# Altium schematic sheet FPGA_connector.SchDoc
size A3; SheetNumber: 13; SheetTotal: 15
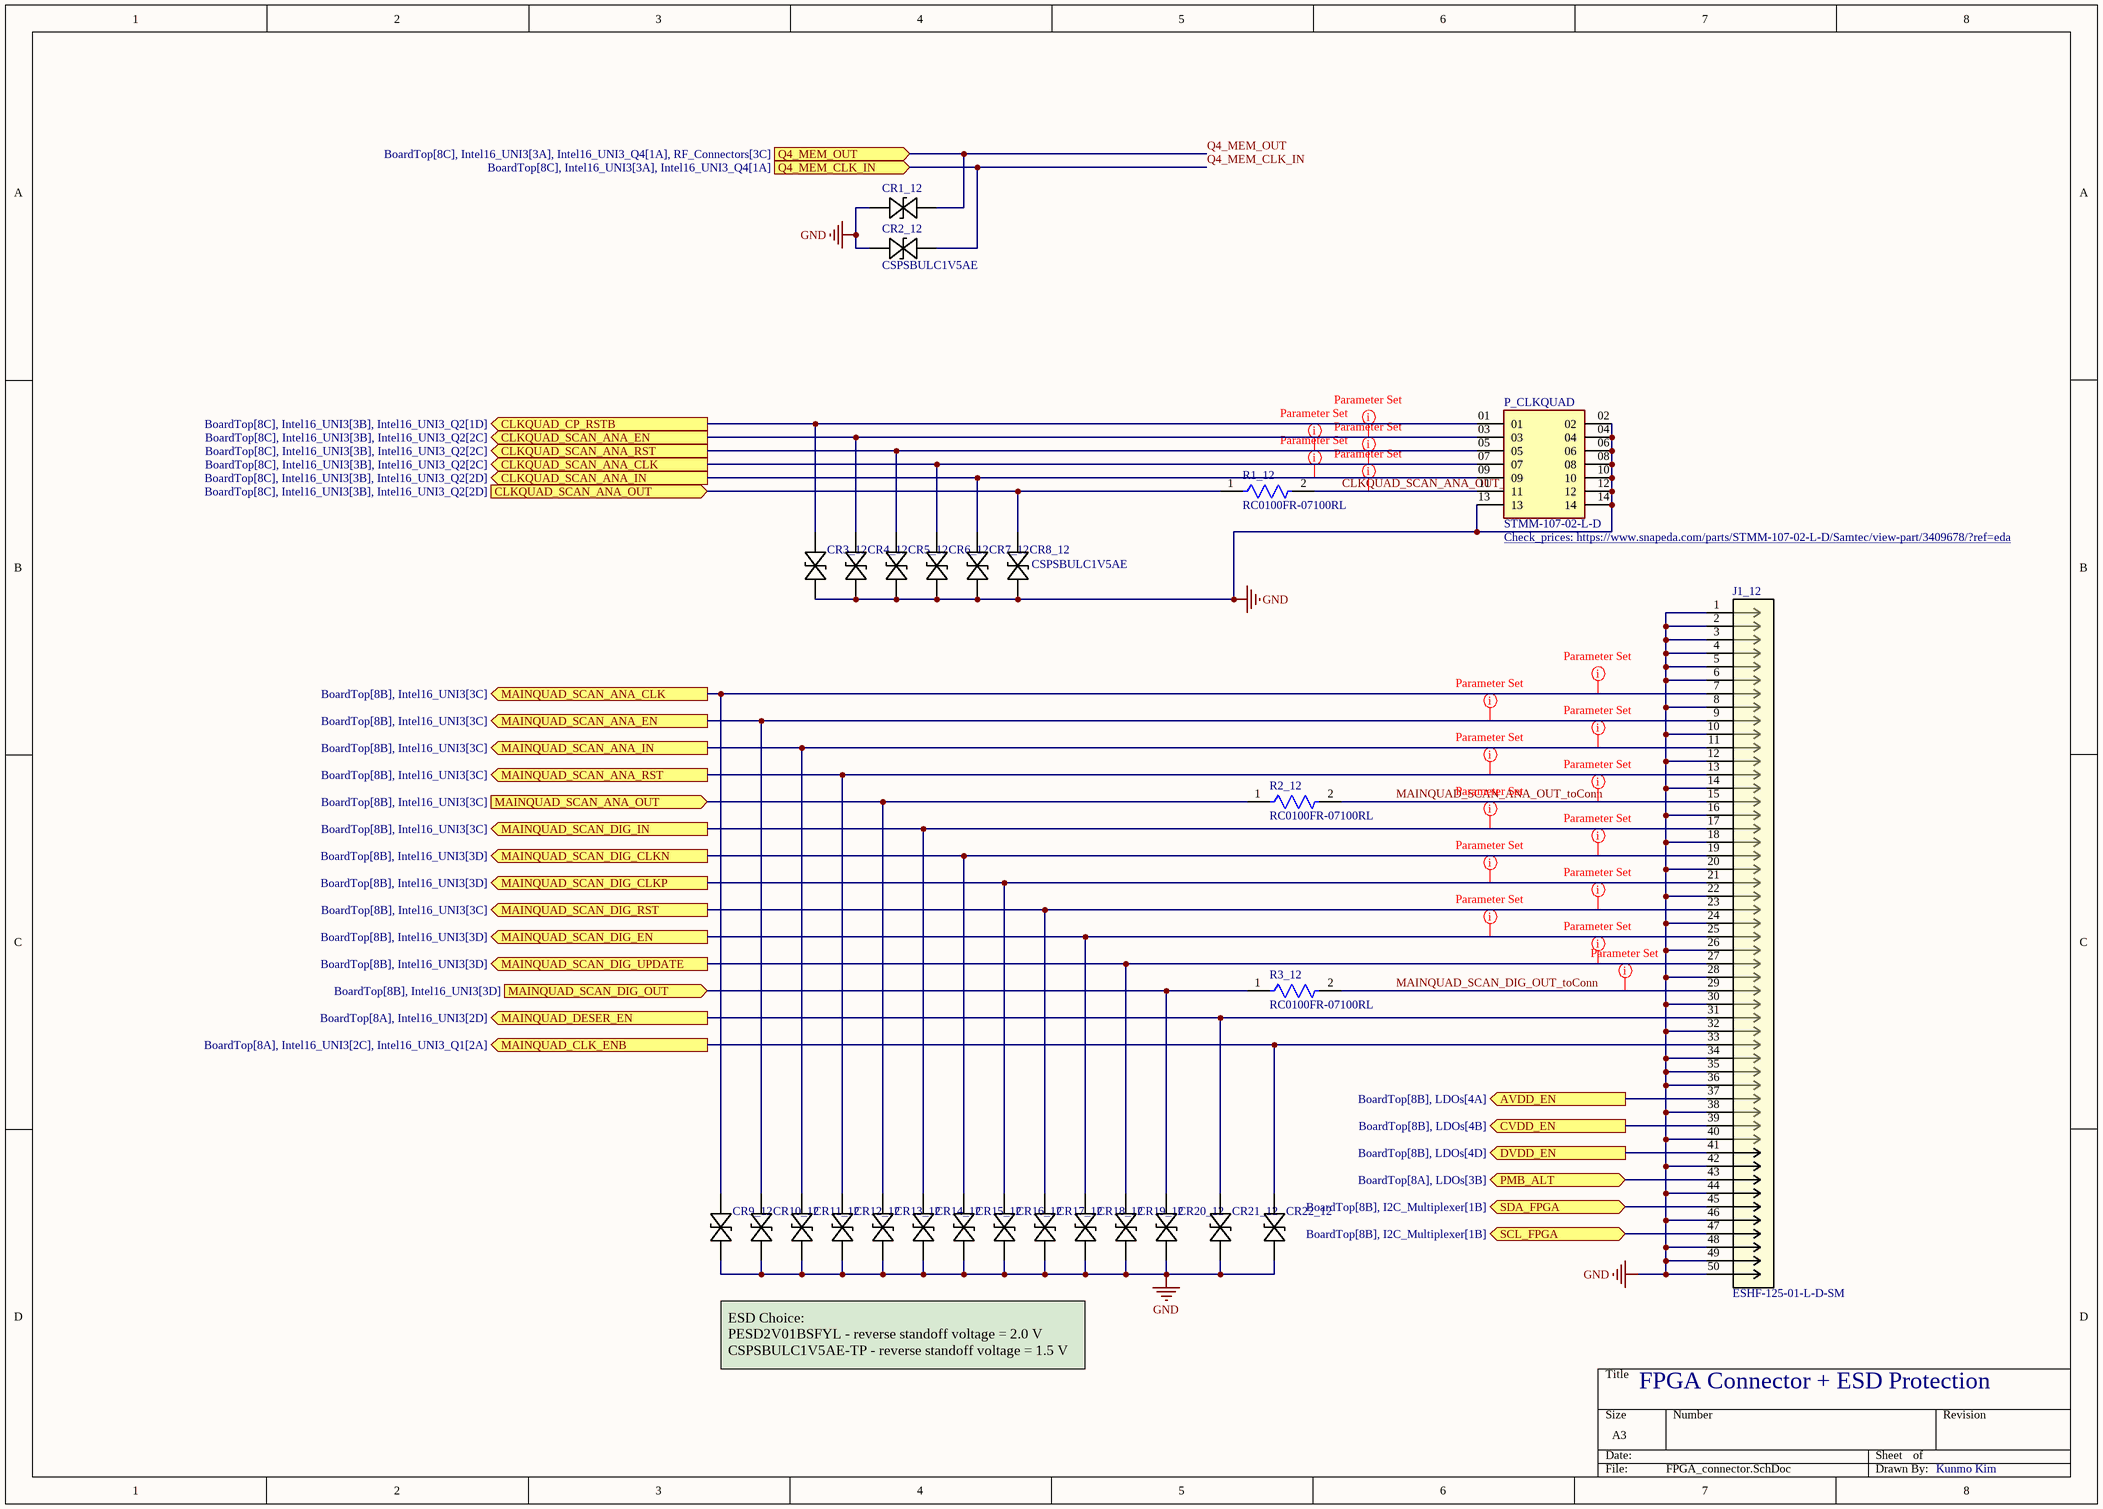
[diagram p0: FPGA_connector.SchDoc]

## Parts
CR1_12  CSPSBULC1V5AE  [WLL-2-1_INF]  (value not drawn)
CR2_12  CSPSBULC1V5AE  [WLL-2-1_INF]
CR3_12  CSPSBULC1V5AE  [WLL-2-1_INF]  (value not drawn)
CR4_12  CSPSBULC1V5AE  [WLL-2-1_INF]  (value not drawn)
CR5_12  CSPSBULC1V5AE  [WLL-2-1_INF]  (value not drawn)
CR6_12  CSPSBULC1V5AE  [WLL-2-1_INF]  (value not drawn)
CR7_12  CSPSBULC1V5AE  [WLL-2-1_INF]  (value not drawn)
CR8_12  CSPSBULC1V5AE  [WLL-2-1_INF]
CR9_12  CSPSBULC1V5AE  [WLL-2-1_INF]  (value not drawn)
CR10_12  CSPSBULC1V5AE  [WLL-2-1_INF]  (value not drawn)
CR11_12  CSPSBULC1V5AE  [WLL-2-1_INF]  (value not drawn)
CR12_12  CSPSBULC1V5AE  [WLL-2-1_INF]  (value not drawn)
CR13_12  CSPSBULC1V5AE  [WLL-2-1_INF]  (value not drawn)
CR14_12  CSPSBULC1V5AE  [WLL-2-1_INF]  (value not drawn)
CR15_12  CSPSBULC1V5AE  [WLL-2-1_INF]  (value not drawn)
CR16_12  CSPSBULC1V5AE  [WLL-2-1_INF]  (value not drawn)
CR17_12  CSPSBULC1V5AE  [WLL-2-1_INF]  (value not drawn)
CR18_12  CSPSBULC1V5AE  [WLL-2-1_INF]  (value not drawn)
CR19_12  CSPSBULC1V5AE  [WLL-2-1_INF]  (value not drawn)
CR20_12  CSPSBULC1V5AE  [WLL-2-1_INF]  (value not drawn)
CR21_12  CSPSBULC1V5AE  [WLL-2-1_INF]  (value not drawn)
CR22_12  CSPSBULC1V5AE  [WLL-2-1_INF]  (value not drawn)
J1_12  ESHF-125-01-L-D-SM  [CONN_ESHF-125-01-x-D-SM_SAI]
P_CLKQUAD  STMM-107-02-L-D  [SAMTEC_STMM-107-02-L-D]
R1_12  RC0100FR-07100RL  [FP-RC0100-0_15-MFG]
R2_12  RC0100FR-07100RL  [FP-RC0100-0_15-MFG]
R3_12  RC0100FR-07100RL  [FP-RC0100-0_15-MFG]

## Ports
AVDD_EN (out, see BoardTop[8B], LDOs[4A]), CLKQUAD_CP_RSTB (out, see BoardTop[8C], Intel16_UNI3[3B], Intel16_UNI3_Q2[1D]), CLKQUAD_SCAN_ANA_CLK (out, see BoardTop[8C], Intel16_UNI3[3B], Intel16_UNI3_Q2[2C]), CLKQUAD_SCAN_ANA_EN (out, see BoardTop[8C], Intel16_UNI3[3B], Intel16_UNI3_Q2[2C]), CLKQUAD_SCAN_ANA_IN (out, see BoardTop[8C], Intel16_UNI3[3B], Intel16_UNI3_Q2[2D]), CLKQUAD_SCAN_ANA_OUT (in, see BoardTop[8C], Intel16_UNI3[3B], Intel16_UNI3_Q2[2D]), CLKQUAD_SCAN_ANA_RST (out, see BoardTop[8C], Intel16_UNI3[3B], Intel16_UNI3_Q2[2C]), CVDD_EN (out, see BoardTop[8B], LDOs[4B]), DVDD_EN (out, see BoardTop[8B], LDOs[4D]), MAINQUAD_CLK_ENB (out, see BoardTop[8A], Intel16_UNI3[2C], Intel16_UNI3_Q1[2A]), MAINQUAD_DESER_EN (out, see BoardTop[8A], Intel16_UNI3[2D]), MAINQUAD_SCAN_ANA_CLK (out, see BoardTop[8B], Intel16_UNI3[3C]), MAINQUAD_SCAN_ANA_EN (out, see BoardTop[8B], Intel16_UNI3[3C]), MAINQUAD_SCAN_ANA_IN (out, see BoardTop[8B], Intel16_UNI3[3C]), MAINQUAD_SCAN_ANA_OUT (in, see BoardTop[8B], Intel16_UNI3[3C]), MAINQUAD_SCAN_ANA_RST (out, see BoardTop[8B], Intel16_UNI3[3C]), MAINQUAD_SCAN_DIG_CLKN (out, see BoardTop[8B], Intel16_UNI3[3D]), MAINQUAD_SCAN_DIG_CLKP (out, see BoardTop[8B], Intel16_UNI3[3D]), MAINQUAD_SCAN_DIG_EN (out, see BoardTop[8B], Intel16_UNI3[3D]), MAINQUAD_SCAN_DIG_IN (out, see BoardTop[8B], Intel16_UNI3[3C]), MAINQUAD_SCAN_DIG_OUT (in, see BoardTop[8B], Intel16_UNI3[3D]), MAINQUAD_SCAN_DIG_RST (out, see BoardTop[8B], Intel16_UNI3[3C]), MAINQUAD_SCAN_DIG_UPDATE (out, see BoardTop[8B], Intel16_UNI3[3D]), PMB_ALT (bidir, see BoardTop[8A], LDOs[3B]), Q4_MEM_CLK_IN (in, see BoardTop[8C], Intel16_UNI3[3A], Intel16_UNI3_Q4[1A]), Q4_MEM_OUT (in, see BoardTop[8C], Intel16_UNI3[3A], Intel16_UNI3_Q4[1A], RF_Connectors[3C]), SCL_FPGA (bidir, see BoardTop[8B], I2C_Multiplexer[1B]), SDA_FPGA (bidir, see BoardTop[8B], I2C_Multiplexer[1B])

## Nets
GND: CR1_12.1 CR2_12.1 CR3_12.2 CR4_12.2 CR5_12.2 CR6_12.2 CR7_12.2 CR8_12.2 CR9_12.2 CR10_12.2 CR11_12.2 CR12_12.2 CR13_12.2 CR14_12.2 CR15_12.2 CR16_12.2 CR17_12.2 CR18_12.2 CR19_12.2 CR20_12.2 CR21_12.2 CR22_12.2 J1_12.1 J1_12.2 J1_12.3 J1_12.4 J1_12.5 J1_12.6 J1_12.8 J1_12.10 J1_12.12 J1_12.14 J1_12.16 J1_12.18 J1_12.20 J1_12.22 J1_12.24 J1_12.26 J1_12.28 J1_12.30 J1_12.32 J1_12.34 J1_12.35 J1_12.36 J1_12.38 J1_12.40 J1_12.42 J1_12.44 J1_12.46 J1_12.48 J1_12.49 J1_12.50 P_CLKQUAD.02 P_CLKQUAD.04 P_CLKQUAD.06 P_CLKQUAD.08 P_CLKQUAD.10 P_CLKQUAD.12 P_CLKQUAD.13 P_CLKQUAD.14
AVDD_EN: J1_12.37 ; port AVDD_EN
CLKQUAD_CP_RSTB: CR3_12.1 P_CLKQUAD.01 ; port CLKQUAD_CP_RSTB
CLKQUAD_SCAN_ANA_CLK: CR6_12.1 P_CLKQUAD.07 ; port CLKQUAD_SCAN_ANA_CLK
CLKQUAD_SCAN_ANA_EN: CR4_12.1 P_CLKQUAD.03 ; port CLKQUAD_SCAN_ANA_EN
CLKQUAD_SCAN_ANA_IN: CR7_12.1 P_CLKQUAD.09 ; port CLKQUAD_SCAN_ANA_IN
CLKQUAD_SCAN_ANA_OUT: CR8_12.1 R1_12.1 ; port CLKQUAD_SCAN_ANA_OUT
CLKQUAD_SCAN_ANA_OUT_toConn: P_CLKQUAD.11 R1_12.2
CLKQUAD_SCAN_ANA_RST: CR5_12.1 P_CLKQUAD.05 ; port CLKQUAD_SCAN_ANA_RST
CVDD_EN: J1_12.39 ; port CVDD_EN
DVDD_EN: J1_12.41 ; port DVDD_EN
MAINQUAD_CLK_ENB: CR22_12.1 J1_12.33 ; port MAINQUAD_CLK_ENB
MAINQUAD_DESER_EN: CR21_12.1 J1_12.31 ; port MAINQUAD_DESER_EN
MAINQUAD_SCAN_ANA_CLK: CR9_12.1 J1_12.7 ; port MAINQUAD_SCAN_ANA_CLK
MAINQUAD_SCAN_ANA_EN: CR10_12.1 J1_12.9 ; port MAINQUAD_SCAN_ANA_EN
MAINQUAD_SCAN_ANA_IN: CR11_12.1 J1_12.11 ; port MAINQUAD_SCAN_ANA_IN
MAINQUAD_SCAN_ANA_OUT: CR13_12.1 R2_12.1 ; port MAINQUAD_SCAN_ANA_OUT
MAINQUAD_SCAN_ANA_OUT_toConn: J1_12.15 R2_12.2
MAINQUAD_SCAN_ANA_RST: CR12_12.1 J1_12.13 ; port MAINQUAD_SCAN_ANA_RST
MAINQUAD_SCAN_DIG_CLKN: CR15_12.1 J1_12.19 ; port MAINQUAD_SCAN_DIG_CLKN
MAINQUAD_SCAN_DIG_CLKP: CR16_12.1 J1_12.21 ; port MAINQUAD_SCAN_DIG_CLKP
MAINQUAD_SCAN_DIG_EN: CR18_12.1 J1_12.25 ; port MAINQUAD_SCAN_DIG_EN
MAINQUAD_SCAN_DIG_IN: CR14_12.1 J1_12.17 ; port MAINQUAD_SCAN_DIG_IN
MAINQUAD_SCAN_DIG_OUT: CR20_12.1 R3_12.1 ; port MAINQUAD_SCAN_DIG_OUT
MAINQUAD_SCAN_DIG_OUT_toConn: J1_12.29 R3_12.2
MAINQUAD_SCAN_DIG_RST: CR17_12.1 J1_12.23 ; port MAINQUAD_SCAN_DIG_RST
MAINQUAD_SCAN_DIG_UPDATE: CR19_12.1 J1_12.27 ; port MAINQUAD_SCAN_DIG_UPDATE
PMB_ALT: J1_12.43 ; port PMB_ALT
Q4_MEM_CLK_IN: CR2_12.2 ; port Q4_MEM_CLK_IN
Q4_MEM_OUT: CR1_12.2 ; port Q4_MEM_OUT
SCL_FPGA: J1_12.47 ; port SCL_FPGA
SDA_FPGA: J1_12.45 ; port SDA_FPGA

## Layout directives
net class CLKQUAD_SCAN_ANA: CLKQUAD_SCAN_ANA_CLK, CLKQUAD_SCAN_ANA_EN, CLKQUAD_SCAN_ANA_IN, CLKQUAD_SCAN_ANA_OUT_toConn, CLKQUAD_SCAN_ANA_RST
net class MAINQUAD_SCAN_ANA: MAINQUAD_SCAN_ANA_CLK, MAINQUAD_SCAN_ANA_EN, MAINQUAD_SCAN_ANA_IN, MAINQUAD_SCAN_ANA_OUT_toConn, MAINQUAD_SCAN_ANA_RST
net class MAINQUAD_SCAN_DIG: MAINQUAD_SCAN_DIG_CLKN, MAINQUAD_SCAN_DIG_CLKP, MAINQUAD_SCAN_DIG_EN, MAINQUAD_SCAN_DIG_IN, MAINQUAD_SCAN_DIG_OUT_toConn, MAINQUAD_SCAN_DIG_RST, MAINQUAD_SCAN_DIG_UPDATE

## Notes on the sheet
- ESD Choice:
  PESD2V01BSFYL - reverse standoff voltage = 2.0 V
  CSPSBULC1V5AE-TP - reverse standoff voltage = 1.5 V
- FPGA Connector + ESD Protection
- Kunmo Kim

## Library data of the parts
CR1_12 CR2_12 CR3_12 CR4_12 CR5_12 CR6_12 CR7_12 CR8_12 CR9_12 CR10_12 CR11_12 CR12_12 CR13_12 CR14_12 CR15_12 CR16_12 CR17_12 CR18_12 CR19_12 CR20_12 CR21_12 CR22_12 = ESD108B1CSP0201XTSA1: No Description Available; Mfr_Name: Infineon
J1_12 = ESHF-125-01-L-D-SM: No Description Available; Mfr_Name: Samtec Inc; Type: Headers, Male Pins; RefDes: RefDes; Supplier 1: Digikey; Supplier Part Number 1: SAM15560-ND; ClassName: InputPowerComponent
P_CLKQUAD = STMM-107-02-L-D: Connector Header Surface Mount 14 position 0.079 (2.00mm); MF: Samtec; MP: STMM-107-02-L-D; SnapEDA_Link: https://www.snapeda.com/parts/STMM-107-02-L-D/Samtec/view-part/3409678/?ref=snap; Package: None; Value: *; Digi-Key_Part_Number: STMM-107-02-L-D-SM-TR-ND; Supplier 1: Mouser; Supplier Part Number 1: 200-STMM10702LD; Check_prices: https://www.snapeda.com/parts/STMM-107-02-L-D/Samtec/view-part/3409678/?ref=eda
R1_12 R2_12 R3_12 = yageo_100ohm: RES SMD 100 OHM 1% 1/32W 01005; Resistance: 113R; Max Power Dissipation: 30mW; Temperature Coefficient: 200ppm/°C; Length: 0.016inch; Resistor Type: Thick Film; Tolerance: 1%; Height: 0.006inch; RoHS Compliant: Yes; Case Code (Imperial): 1005; Width: 0.008inch; Packaging: Tape and Reel; Case Code (Metric): 0402; Min Operating Temperature: -55°C; Max Operating Temperature: 125°C; Features: Moisture Resistant; Number of Terminations: 2; Supplier 1: Digikey; Supplier Part Number 1: 311-100DGCT-ND